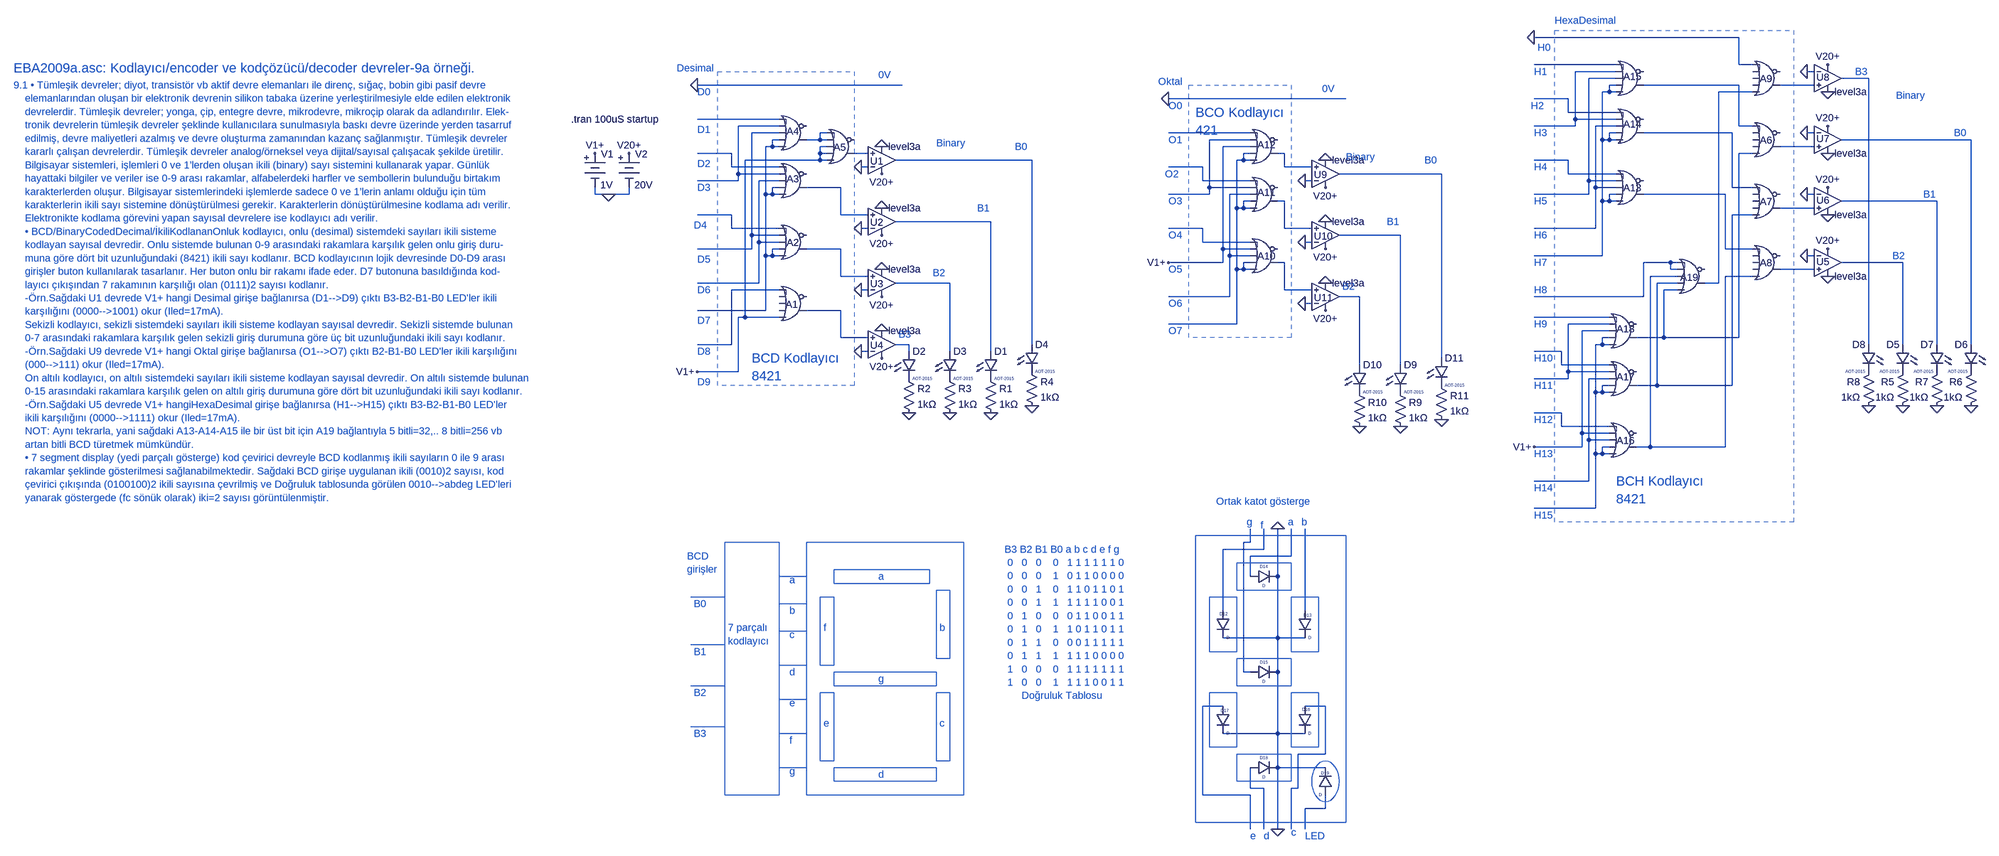
[diagram p0: schematic EBA2009a.asc]
EBA2009a.asc, the LTspice schematic file:
Version 4
SHEET 1 7064 4332
WIRE 4160 -16 3680 -16
WIRE 3872 48 3680 48
WIRE 4160 48 4160 -16
WIRE 4192 48 4160 48
WIRE 3872 64 3776 64
WIRE 4336 64 4320 64
WIRE 3872 80 3808 80
WIRE 4464 80 4400 80
WIRE 2032 96 1552 96
WIRE 3872 96 3856 96
WIRE 4160 96 3936 96
WIRE 4336 96 4256 96
WIRE 3856 112 3856 96
WIRE 3856 112 3840 112
WIRE 3872 112 3856 112
WIRE 4192 112 4112 112
WIRE 3072 128 2656 128
WIRE 3760 128 3680 128
WIRE 3760 160 3760 128
WIRE 3872 160 3760 160
WIRE 1744 176 1552 176
WIRE 3776 176 3776 64
WIRE 3872 176 3776 176
WIRE 1744 192 1648 192
WIRE 3776 192 3776 176
WIRE 3776 192 3680 192
WIRE 3872 192 3824 192
WIRE 4160 192 4160 96
WIRE 4192 192 4160 192
WIRE 1744 208 1680 208
WIRE 1856 208 1840 208
WIRE 2848 208 2656 208
WIRE 3872 208 3856 208
WIRE 4144 208 3936 208
WIRE 4336 208 4320 208
WIRE 1744 224 1728 224
WIRE 1840 224 1840 208
WIRE 1840 224 1808 224
WIRE 1856 224 1840 224
WIRE 2848 224 2752 224
WIRE 3840 224 3840 112
WIRE 3856 224 3856 208
WIRE 3856 224 3840 224
WIRE 3872 224 3856 224
WIRE 4704 224 4400 224
WIRE 1728 240 1728 224
WIRE 1728 240 1712 240
WIRE 1744 240 1728 240
WIRE 1856 240 1840 240
WIRE 2848 240 2784 240
WIRE 4336 240 4256 240
WIRE 1632 256 1552 256
WIRE 1840 256 1840 240
WIRE 1856 256 1840 256
WIRE 1952 256 1920 256
WIRE 2848 256 2832 256
WIRE 2928 256 2912 256
WIRE 4192 256 4160 256
WIRE 1840 272 1840 256
WIRE 1840 272 1664 272
WIRE 1856 272 1840 272
WIRE 2336 272 2016 272
WIRE 2832 272 2832 256
WIRE 2832 272 2816 272
WIRE 2848 272 2832 272
WIRE 3760 272 3680 272
WIRE 1632 288 1632 256
WIRE 1744 288 1632 288
WIRE 1952 288 1936 288
WIRE 2736 288 2656 288
WIRE 2928 288 2928 256
WIRE 2992 288 2928 288
WIRE 1648 304 1648 192
WIRE 1744 304 1648 304
WIRE 3296 304 3056 304
WIRE 3760 304 3760 272
WIRE 3872 304 3760 304
WIRE 1648 320 1648 304
WIRE 1648 320 1552 320
WIRE 1744 320 1696 320
WIRE 2736 320 2736 288
WIRE 2848 320 2736 320
WIRE 2992 320 2976 320
WIRE 3808 320 3808 80
WIRE 3872 320 3808 320
WIRE 1744 336 1728 336
WIRE 1888 336 1808 336
WIRE 2752 336 2752 224
WIRE 2848 336 2752 336
WIRE 3824 336 3824 192
WIRE 3872 336 3824 336
WIRE 4144 336 4144 208
WIRE 4192 336 4144 336
WIRE 1312 352 1312 336
WIRE 1344 352 1312 352
WIRE 1392 352 1392 336
WIRE 1392 352 1344 352
WIRE 1712 352 1712 240
WIRE 1728 352 1728 336
WIRE 1728 352 1712 352
WIRE 1744 352 1728 352
WIRE 2752 352 2752 336
WIRE 2752 352 2656 352
WIRE 2848 352 2800 352
WIRE 3808 352 3808 320
WIRE 3808 352 3680 352
WIRE 3872 352 3856 352
WIRE 4128 352 3936 352
WIRE 4336 352 4320 352
WIRE 2848 368 2832 368
WIRE 2928 368 2912 368
WIRE 3840 368 3840 224
WIRE 3856 368 3856 352
WIRE 3856 368 3840 368
WIRE 3872 368 3856 368
WIRE 4624 368 4400 368
WIRE 2816 384 2816 272
WIRE 2832 384 2832 368
WIRE 2832 384 2816 384
WIRE 2848 384 2832 384
WIRE 4336 384 4256 384
WIRE 1632 400 1552 400
WIRE 1888 400 1888 336
WIRE 1952 400 1888 400
WIRE 4192 400 4144 400
WIRE 2240 416 2016 416
WIRE 1632 432 1632 400
WIRE 1744 432 1632 432
WIRE 1952 432 1936 432
WIRE 2736 432 2656 432
WIRE 2928 432 2928 368
WIRE 2992 432 2928 432
WIRE 3824 432 3824 336
WIRE 3824 432 3680 432
WIRE 1680 448 1680 208
WIRE 1744 448 1680 448
WIRE 3200 448 3056 448
WIRE 1696 464 1696 320
WIRE 1744 464 1696 464
WIRE 2736 464 2736 432
WIRE 2848 464 2736 464
WIRE 2992 464 2976 464
WIRE 1680 480 1680 448
WIRE 1680 480 1552 480
WIRE 1744 480 1728 480
WIRE 1888 480 1808 480
WIRE 2784 480 2784 240
WIRE 2848 480 2784 480
WIRE 4128 480 4128 352
WIRE 4192 480 4128 480
WIRE 1712 496 1712 352
WIRE 1728 496 1728 480
WIRE 1728 496 1712 496
WIRE 1744 496 1728 496
WIRE 2800 496 2800 352
WIRE 2848 496 2800 496
WIRE 3840 496 3840 368
WIRE 3840 496 3680 496
WIRE 4336 496 4320 496
WIRE 2784 512 2784 480
WIRE 2784 512 2656 512
WIRE 2848 512 2832 512
WIRE 2928 512 2912 512
WIRE 4000 512 3936 512
WIRE 4016 512 4000 512
WIRE 4544 512 4400 512
WIRE 2816 528 2816 384
WIRE 2832 528 2832 512
WIRE 2832 528 2816 528
WIRE 2848 528 2832 528
WIRE 4000 528 4000 512
WIRE 4016 528 4000 528
WIRE 4336 528 4256 528
WIRE 1888 544 1888 480
WIRE 1952 544 1888 544
WIRE 4016 544 3952 544
WIRE 4192 544 4128 544
WIRE 1696 560 1696 464
WIRE 1696 560 1552 560
WIRE 2144 560 2016 560
WIRE 4016 560 3968 560
WIRE 4112 560 4112 112
WIRE 4112 560 4080 560
WIRE 1744 576 1632 576
WIRE 1952 576 1936 576
WIRE 2928 576 2928 512
WIRE 2992 576 2928 576
WIRE 4016 576 3984 576
WIRE 2800 592 2800 496
WIRE 2800 592 2656 592
WIRE 3104 592 3056 592
WIRE 3936 592 3936 512
WIRE 3936 592 3680 592
WIRE 2992 608 2976 608
WIRE 1712 624 1712 496
WIRE 1712 624 1552 624
WIRE 1888 624 1808 624
WIRE 1664 640 1664 272
WIRE 1664 640 1648 640
WIRE 1744 640 1664 640
WIRE 3856 640 3680 640
WIRE 2816 656 2816 528
WIRE 2816 656 2656 656
WIRE 3856 656 3760 656
WIRE 3856 672 3792 672
WIRE 1888 688 1888 624
WIRE 1952 688 1888 688
WIRE 3856 688 3840 688
WIRE 3984 688 3984 576
WIRE 3984 688 3920 688
WIRE 4160 688 4160 256
WIRE 4160 688 3984 688
WIRE 1632 704 1632 576
WIRE 1632 704 1552 704
WIRE 2048 704 2016 704
WIRE 2336 704 2336 272
WIRE 3840 704 3840 688
WIRE 3840 704 3824 704
WIRE 3856 704 3840 704
WIRE 4464 704 4464 80
WIRE 4544 704 4544 512
WIRE 4624 704 4624 368
WIRE 4704 704 4704 224
WIRE 1952 720 1936 720
WIRE 2048 720 2048 704
WIRE 2144 720 2144 560
WIRE 2240 720 2240 416
WIRE 3744 720 3680 720
WIRE 3296 736 3296 304
WIRE 3104 752 3104 592
WIRE 3200 752 3200 448
WIRE 3744 752 3744 720
WIRE 3856 752 3744 752
WIRE 1648 768 1648 640
WIRE 1648 768 1552 768
WIRE 3760 768 3760 656
WIRE 3856 768 3760 768
WIRE 3760 784 3760 768
WIRE 3760 784 3680 784
WIRE 3856 784 3808 784
WIRE 3856 800 3840 800
WIRE 3968 800 3968 560
WIRE 3968 800 3920 800
WIRE 4144 800 4144 400
WIRE 4144 800 3968 800
WIRE 3824 816 3824 704
WIRE 3840 816 3840 800
WIRE 3840 816 3824 816
WIRE 3856 816 3840 816
WIRE 3744 864 3680 864
WIRE 3744 896 3744 864
WIRE 3856 896 3744 896
WIRE 3792 912 3792 672
WIRE 3856 912 3792 912
WIRE 3808 928 3808 784
WIRE 3856 928 3808 928
WIRE 3792 944 3792 912
WIRE 3792 944 3680 944
WIRE 3856 944 3840 944
WIRE 3952 944 3952 544
WIRE 3952 944 3920 944
WIRE 4128 944 4128 544
WIRE 4128 944 3952 944
WIRE 3824 960 3824 816
WIRE 3840 960 3840 944
WIRE 3840 960 3824 960
WIRE 3856 960 3840 960
WIRE 3808 1024 3808 928
WIRE 3808 1024 3680 1024
WIRE 3824 1088 3824 960
WIRE 3824 1088 3680 1088
WIRE 2848 1168 2848 1136
WIRE 2848 1168 2832 1168
WIRE 2880 1184 2880 1136
WIRE 2880 1184 2784 1184
WIRE 2944 1200 2944 1136
WIRE 2944 1200 2848 1200
WIRE 2848 1248 2848 1200
WIRE 2912 1248 2912 1136
WIRE 2784 1328 2784 1184
WIRE 2976 1328 2976 1136
WIRE 2912 1392 2912 1248
WIRE 2912 1392 2784 1392
WIRE 2976 1392 2912 1392
WIRE 2832 1472 2832 1168
WIRE 2848 1472 2832 1472
WIRE 2912 1472 2912 1392
WIRE 2784 1552 2736 1552
WIRE 3024 1552 2976 1552
WIRE 2912 1616 2912 1472
WIRE 2912 1616 2784 1616
WIRE 2976 1616 2912 1616
WIRE 3024 1664 3024 1552
WIRE 3024 1664 2960 1664
WIRE 2912 1696 2912 1616
WIRE 3024 1696 2912 1696
WIRE 2848 1744 2848 1696
WIRE 2880 1744 2848 1744
WIRE 2960 1744 2960 1664
WIRE 2960 1744 2944 1744
WIRE 2736 1760 2736 1552
WIRE 2848 1760 2736 1760
WIRE 3024 1792 3024 1760
WIRE 3024 1792 2976 1792
WIRE 2848 1840 2848 1760
WIRE 2880 1840 2880 1744
WIRE 2912 1840 2912 1696
WIRE 2944 1840 2944 1744
WIRE 2976 1840 2976 1792
FLAG 1984 240 0
FLAG 1984 304 V20+
FLAG 1936 288 0
FLAG 2240 864 0
FLAG 2048 864 0
FLAG 2144 864 0
FLAG 1552 768 V1+
FLAG 1312 256 V1+
FLAG 1392 256 V20+
FLAG 1344 352 0
FLAG 2336 848 0
FLAG 1984 384 0
FLAG 1984 448 V20+
FLAG 1936 432 0
FLAG 1984 528 0
FLAG 1984 592 V20+
FLAG 1936 576 0
FLAG 1984 672 0
FLAG 1984 736 V20+
FLAG 1936 720 0
FLAG 1552 96 0
FLAG 4368 544 0
FLAG 4368 480 V20+
FLAG 4320 496 0
FLAG 4544 848 0
FLAG 4368 400 0
FLAG 4368 336 V20+
FLAG 4320 352 0
FLAG 4368 256 0
FLAG 4368 192 V20+
FLAG 4320 208 0
FLAG 4704 848 0
FLAG 4624 848 0
FLAG 4368 112 0
FLAG 4368 48 V20+
FLAG 4320 64 0
FLAG 4464 848 0
FLAG 3024 272 0
FLAG 3024 336 V20+
FLAG 2976 320 0
FLAG 3200 896 0
FLAG 3104 896 0
FLAG 2656 512 V1+
FLAG 3296 880 0
FLAG 3024 416 0
FLAG 3024 480 V20+
FLAG 2976 464 0
FLAG 3024 560 0
FLAG 3024 624 V20+
FLAG 2976 608 0
FLAG 2656 128 0
FLAG 3680 944 V1+
FLAG 3680 -16 0
FLAG 2912 1136 0
FLAG 2912 1840 0
SYMBOL Digital\\or 1776 672 M180
WINDOW 0 -17 62 Left 2
SYMATTR InstName A1
SYMBOL Digital\\or 1776 528 M180
WINDOW 0 -15 63 Left 2
SYMATTR InstName A2
SYMBOL Digital\\or 1776 384 M180
WINDOW 0 -15 68 Left 2
SYMATTR InstName A3
SYMBOL OpAmps\\UniversalOpAmp3 1984 272 M180
WINDOW 0 -27 -2 Left 2
SYMATTR InstName U1
SYMBOL res 2224 768 R0
SYMATTR InstName R1
SYMATTR Value 1kΩ
SYMBOL LED 2224 720 R0
WINDOW 3 24 64 Left 0
SYMATTR Value AOT-2015
SYMATTR InstName D1
SYMATTR Description Diode
SYMATTR Type diode
SYMBOL res 2032 768 R0
SYMATTR InstName R2
SYMATTR Value 1kΩ
SYMBOL LED 2032 720 R0
WINDOW 3 24 64 Left 0
SYMATTR Value AOT-2015
SYMATTR InstName D2
SYMATTR Description Diode
SYMATTR Type diode
SYMBOL res 2128 768 R0
SYMATTR InstName R3
SYMATTR Value 1kΩ
SYMBOL LED 2128 720 R0
WINDOW 3 24 64 Left 0
SYMATTR Value AOT-2015
SYMATTR InstName D3
SYMATTR Description Diode
SYMATTR Type diode
SYMBOL Misc\\battery 1312 240 R0
WINDOW 0 14 18 Left 2
WINDOW 3 13 90 Left 2
SYMATTR InstName V1
SYMATTR Value 1V
SYMBOL Misc\\battery 1392 240 R0
WINDOW 0 14 18 Left 2
WINDOW 3 13 90 Left 2
SYMATTR InstName V2
SYMATTR Value 20V
SYMBOL Digital\\or 1776 272 M180
WINDOW 0 -15 68 Left 2
SYMATTR InstName A4
SYMBOL Digital\\or 1888 304 M180
WINDOW 0 -17 62 Left 2
SYMATTR InstName A5
SYMBOL res 2320 752 R0
SYMATTR InstName R4
SYMATTR Value 1kΩ
SYMBOL LED 2320 704 R0
WINDOW 3 24 64 Left 0
SYMATTR Value AOT-2015
SYMATTR InstName D4
SYMATTR Description Diode
SYMATTR Type diode
SYMBOL OpAmps\\UniversalOpAmp3 1984 416 M180
WINDOW 0 -27 -2 Left 2
SYMATTR InstName U2
SYMBOL OpAmps\\UniversalOpAmp3 1984 560 M180
WINDOW 0 -27 -2 Left 2
SYMATTR InstName U3
SYMBOL OpAmps\\UniversalOpAmp3 1984 704 M180
WINDOW 0 -27 -2 Left 2
SYMATTR InstName U4
SYMBOL OpAmps\\UniversalOpAmp3 4368 512 R0
WINDOW 0 -27 -2 Left 2
SYMATTR InstName U5
SYMBOL res 4560 752 M0
SYMATTR InstName R5
SYMATTR Value 1kΩ
SYMBOL LED 4560 704 M0
WINDOW 3 24 64 Left 0
SYMATTR Value AOT-2015
SYMATTR InstName D5
SYMATTR Description Diode
SYMATTR Type diode
SYMBOL OpAmps\\UniversalOpAmp3 4368 368 R0
WINDOW 0 -27 -2 Left 2
SYMATTR InstName U6
SYMBOL OpAmps\\UniversalOpAmp3 4368 224 R0
WINDOW 0 -27 -2 Left 2
SYMATTR InstName U7
SYMBOL res 4720 752 M0
SYMATTR InstName R6
SYMATTR Value 1kΩ
SYMBOL LED 4720 704 M0
WINDOW 3 24 64 Left 0
SYMATTR Value AOT-2015
SYMATTR InstName D6
SYMATTR Description Diode
SYMATTR Type diode
SYMBOL res 4640 752 M0
SYMATTR InstName R7
SYMATTR Value 1kΩ
SYMBOL LED 4640 704 M0
WINDOW 3 24 64 Left 0
SYMATTR Value AOT-2015
SYMATTR InstName D7
SYMATTR Description Diode
SYMATTR Type diode
SYMBOL Digital\\or 4224 288 M180
WINDOW 0 -15 63 Left 2
SYMATTR InstName A6
SYMBOL Digital\\or 4224 432 M180
WINDOW 0 -15 63 Left 2
SYMATTR InstName A7
SYMBOL Digital\\or 4224 576 M180
WINDOW 0 -15 63 Left 2
SYMATTR InstName A8
SYMBOL Digital\\or 4224 144 M180
WINDOW 0 -15 63 Left 2
SYMATTR InstName A9
SYMBOL OpAmps\\UniversalOpAmp3 4368 80 R0
WINDOW 0 -27 -2 Left 2
SYMATTR InstName U8
SYMBOL res 4480 752 M0
SYMATTR InstName R8
SYMATTR Value 1kΩ
SYMBOL LED 4480 704 M0
WINDOW 3 24 64 Left 0
SYMATTR Value AOT-2015
SYMATTR InstName D8
SYMATTR Description Diode
SYMATTR Type diode
SYMBOL Digital\\or 2880 560 M180
WINDOW 0 -15 63 Left 2
SYMATTR InstName A10
SYMBOL Digital\\or 2880 416 M180
WINDOW 0 -15 68 Left 2
SYMATTR InstName A11
SYMBOL OpAmps\\UniversalOpAmp3 3024 304 M180
WINDOW 0 -27 -2 Left 2
SYMATTR InstName U9
SYMBOL res 3184 800 R0
SYMATTR InstName R9
SYMATTR Value 1kΩ
SYMBOL LED 3184 752 R0
WINDOW 3 24 64 Left 0
SYMATTR Value AOT-2015
SYMATTR InstName D9
SYMATTR Description Diode
SYMATTR Type diode
SYMBOL res 3088 800 R0
SYMATTR InstName R10
SYMATTR Value 1kΩ
SYMBOL LED 3088 752 R0
WINDOW 3 24 64 Left 0
SYMATTR Value AOT-2015
SYMATTR InstName D10
SYMATTR Description Diode
SYMATTR Type diode
SYMBOL Digital\\or 2880 304 M180
WINDOW 0 -15 68 Left 2
SYMATTR InstName A12
SYMBOL res 3280 784 R0
SYMATTR InstName R11
SYMATTR Value 1kΩ
SYMBOL LED 3280 736 R0
WINDOW 3 24 64 Left 0
SYMATTR Value AOT-2015
SYMATTR InstName D11
SYMATTR Description Diode
SYMATTR Type diode
SYMBOL OpAmps\\UniversalOpAmp3 3024 448 M180
WINDOW 0 -27 -2 Left 2
SYMATTR InstName U10
SYMBOL OpAmps\\UniversalOpAmp3 3024 592 M180
WINDOW 0 -27 -2 Left 2
SYMATTR InstName U11
SYMBOL Digital\\or 3904 400 M180
WINDOW 0 -15 63 Left 2
SYMATTR InstName A13
SYMBOL Digital\\or 3904 256 M180
WINDOW 0 -15 68 Left 2
SYMATTR InstName A14
SYMBOL Digital\\or 3904 144 M180
WINDOW 0 -15 68 Left 2
SYMATTR InstName A15
SYMBOL Digital\\or 3888 992 M180
WINDOW 0 -15 63 Left 2
SYMATTR InstName A16
SYMBOL Digital\\or 3888 848 M180
WINDOW 0 -15 68 Left 2
SYMATTR InstName A17
SYMBOL Digital\\or 3888 736 M180
WINDOW 0 -15 68 Left 2
SYMATTR InstName A18
SYMBOL Digital\\or 4048 608 M180
WINDOW 0 -26 61 Left 2
SYMATTR InstName A19
SYMBOL diode 2768 1328 R0
WINDOW 0 8 8 Left 0
WINDOW 3 24 64 Left 0
SYMATTR InstName D12
SYMBOL diode 2960 1328 R0
WINDOW 0 13 11 Left 0
WINDOW 3 24 64 Left 0
SYMATTR InstName D13
SYMBOL diode 2848 1264 R270
WINDOW 0 32 32 VTop 0
WINDOW 3 0 32 VBottom 0
SYMATTR InstName D14
SYMBOL diode 2848 1488 R270
WINDOW 0 32 32 VTop 0
WINDOW 3 0 32 VBottom 0
SYMATTR InstName D15
SYMBOL diode 2960 1552 R0
WINDOW 0 10 8 Left 0
WINDOW 3 24 64 Left 0
SYMATTR InstName D16
SYMBOL diode 2768 1552 R0
WINDOW 0 11 11 Left 0
WINDOW 3 24 64 Left 0
SYMATTR InstName D17
SYMBOL diode 2848 1712 R270
WINDOW 0 32 32 VTop 0
WINDOW 3 0 32 VBottom 0
SYMATTR InstName D18
SYMBOL diode 3040 1760 R180
WINDOW 0 8 51 Left 0
WINDOW 3 24 0 Left 0
SYMATTR InstName D19
TEXT -232 56 Left 3 ;EBA2009a.asc: Kodlayıcı/encoder ve kodçözücü/decoder devreler-9a örneği.
TEXT -232 96 Left 2 ;9.1 • Tümleşik devreler; diyot, transistör vb aktif devre elemanları ile direnç, sığaç, bobin gibi pasif devre \n    elemanlarından oluşan bir elektronik devrenin silikon tabaka üzerine yerleştirilmesiyle elde edilen elektronik \n    devrelerdir. Tümleşik devreler; yonga, çip, entegre devre, mikrodevre, mikroçip olarak da adlandırılır. Elek-\n    tronik devrelerin tümleşik devreler şeklinde kullanıcılara sunulmasıyla baskı devre üzerinde yerden tasarruf \n    edilmiş, devre maliyetleri azalmış ve devre oluşturma zamanından kazanç sağlanmıştır. Tümleşik devreler \n    kararlı çalışan devrelerdir. Tümleşik devreler analog/örneksel veya dijital/sayısal çalışacak şekilde üretilir.\n    Bilgisayar sistemleri, işlemleri 0 ve 1’lerden oluşan ikili (binary) sayı sistemini kullanarak yapar. Günlük\n    hayattaki bilgiler ve veriler ise 0-9 arası rakamlar, alfabelerdeki harfler ve sembollerin bulunduğu birtakım \n    karakterlerden oluşur. Bilgisayar sistemlerindeki işlemlerde sadece 0 ve 1’lerin anlamı olduğu için tüm \n    karakterlerin ikili sayı sistemine dönüştürülmesi gerekir. Karakterlerin dönüştürülmesine kodlama adı verilir. \n    Elektronikte kodlama görevini yapan sayısal devrelere ise kodlayıcı adı verilir.\n    • BCD/BinaryCodedDecimal/İkiliKodlananOnluk kodlayıcı, onlu (desimal) sistemdeki sayıları ikili sisteme \n    kodlayan sayısal devredir. Onlu sistemde bulunan 0-9 arasındaki rakamlara karşılık gelen onlu giriş duru-\n    muna göre dört bit uzunluğundaki (8421) ikili sayı kodlanır. BCD kodlayıcının lojik devresinde D0-D9 arası \n    girişler buton kullanılarak tasarlanır. Her buton onlu bir rakamı ifade eder. D7 butonuna basıldığında kod-\n    layıcı çıkışından 7 rakamının karşılığı olan (0111)2 sayısı kodlanır.\n    -Örn.Sağdaki U1 devrede V1+ hangi Desimal girişe bağlanırsa (D1-->D9) çıktı B3-B2-B1-B0 LED'ler ikili\n    karşılığını (0000-->1001) okur (Iled=17mA).\n    Sekizli kodlayıcı, sekizli sistemdeki sayıları ikili sisteme kodlayan sayısal devredir. Sekizli sistemde bulunan\n    0-7 arasındaki rakamlara karşılık gelen sekizli giriş durumuna göre üç bit uzunluğundaki ikili sayı kodlanır.\n    -Örn.Sağdaki U9 devrede V1+ hangi Oktal girişe bağlanırsa (O1-->O7) çıktı B2-B1-B0 LED'ler ikili karşılığını \n    (000-->111) okur (Iled=17mA).\n    On altılı kodlayıcı, on altılı sistemdeki sayıları ikili sisteme kodlayan sayısal devredir. On altılı sistemde bulunan \n    0-15 arasındaki rakamlara karşılık gelen on altılı giriş durumuna göre dört bit uzunluğundaki ikili sayı kodlanır.\n    -Örn.Sağdaki U5 devrede V1+ hangiHexaDesimal girişe bağlanırsa (H1-->H15) çıktı B3-B2-B1-B0 LED'ler \n    ikili karşılığını (0000-->1111) okur (Iled=17mA).\n    NOT: Aynı tekrarla, yani sağdaki A13-A14-A15 ile bir üst bit için A19 bağlantıyla 5 bitli=32,.. 8 bitli=256 vb\n    artan bitli BCD türetmek mümkündür.\n    • 7 segment display (yedi parçalı gösterge) kod çevirici devreyle BCD kodlanmış ikili sayıların 0 ile 9 arası \n    rakamlar şeklinde gösterilmesi sağlanabilmektedir. Sağdaki BCD girişe uygulanan ikili (0010)2 sayısı, kod \n    çevirici çıkışında (0100100)2 ikili sayısına çevrilmiş ve Doğruluk tablosunda görülen 0010-->abdeg LED'leri\n    yanarak göstergede (fc sönük olarak) iki=2 sayısı görüntülenmiştir.
TEXT 1552 648 Left 2 ;D7
TEXT 1552 576 Left 2 ;D6
TEXT 1552 504 Left 2 ;D5
TEXT 1544 424 Left 2 ;D4
TEXT 1552 336 Left 2 ;D3
TEXT 1552 280 Left 2 ;D2
TEXT 1552 200 Left 2 ;D1
TEXT 1552 112 Left 2 ;D0
TEXT 1256 176 Left 2 !.tran 100uS startup
TEXT 1552 792 Left 2 ;D9
TEXT 1552 720 Left 2 ;D8
TEXT 2296 240 Left 2 ;B0
TEXT 2208 384 Left 2 ;B1
TEXT 2104 536 Left 2 ;B2
TEXT 2024 680 Left 2 ;B3
TEXT 1976 72 Left 2 ;0V
TEXT 1680 736 Left 3 ;BCD Kodlayıcı\n8421
TEXT 2112 232 Left 2 ;Binary
TEXT 1504 56 Left 2 ;Desimal
TEXT 4664 208 Left 2 ;B0
TEXT 4592 352 Left 2 ;B1
TEXT 4520 496 Left 2 ;B2
TEXT 4432 64 Left 2 ;B3
TEXT 4528 120 Left 2 ;Binary
TEXT 2656 672 Left 2 ;O7
TEXT 2656 608 Left 2 ;O6
TEXT 2656 528 Left 2 ;O5
TEXT 2656 448 Left 2 ;O4
TEXT 2656 368 Left 2 ;O3
TEXT 2648 304 Left 2 ;O2
TEXT 2656 224 Left 2 ;O1
TEXT 2656 144 Left 2 ;O0
TEXT 3256 272 Left 2 ;B0
TEXT 3168 416 Left 2 ;B1
TEXT 3064 568 Left 2 ;B2
TEXT 3016 104 Left 2 ;0V
TEXT 2720 160 Left 3 ;BCO Kodlayıcı\n421
TEXT 3072 264 Left 2 ;Binary
TEXT 2632 88 Left 2 ;Oktal
TEXT 3680 512 Left 2 ;H7
TEXT 3680 448 Left 2 ;H6
TEXT 3680 368 Left 2 ;H5
TEXT 3680 288 Left 2 ;H4
TEXT 3680 208 Left 2 ;H3
TEXT 3672 144 Left 2 ;H2
TEXT 3680 64 Left 2 ;H1
TEXT 3688 8 Left 2 ;H0
TEXT 3680 1104 Left 2 ;H15
TEXT 3680 1040 Left 2 ;H14
TEXT 3680 960 Left 2 ;H13
TEXT 3680 880 Left 2 ;H12
TEXT 3680 800 Left 2 ;H11
TEXT 3680 736 Left 2 ;H10
TEXT 3680 656 Left 2 ;H9
TEXT 3680 576 Left 2 ;H8
TEXT 3728 -56 Left 2 ;HexaDesimal
TEXT 3872 1024 Left 3 ;BCH Kodlayıcı\n8421
TEXT 1544 1312 Left 2 ;B0
TEXT 1544 1424 Left 2 ;B1
TEXT 1544 1520 Left 2 ;B2
TEXT 1544 1616 Left 2 ;B3
TEXT 1768 1256 Left 2 ;a
TEXT 1768 1328 Left 2 ;b
TEXT 1768 1384 Left 2 ;c
TEXT 1768 1472 Left 2 ;d
TEXT 1768 1544 Left 2 ;e
TEXT 1768 1632 Left 2 ;f
TEXT 1768 1704 Left 2 ;g
TEXT 1976 1248 Left 2 ;a
TEXT 2120 1368 Left 2 ;b
TEXT 2120 1592 Left 2 ;c
TEXT 1976 1712 Left 2 ;d
TEXT 1848 1592 Left 2 ;e
TEXT 1848 1368 Left 2 ;f
TEXT 1976 1488 Left 2 ;g
TEXT 1528 1200 Left 2 ;BCD \ngirişler
TEXT 1624 1368 Left 2 ;7 parçalı\nkodlayıcı
TEXT 2272 1184 Left 2 ;B3 B2 B1 B0 a b c d e f g\n 0   0   0    0   1 1 1 1 1 1 0\n 0   0   0    1   0 1 1 0 0 0 0\n 0   0   1    0   1 1 0 1 1 0 1\n 0   0   1    1   1 1 1 1 0 0 1\n 0   1   0    0   0 1 1 0 0 1 1\n 0   1   0    1   1 0 1 1 0 1 1\n 0   1   1    0   0 0 1 1 1 1 1\n 0   1   1    1   1 1 1 0 0 0 0\n 1   0   0    0   1 1 1 1 1 1 1\n 1   0   0    1   1 1 1 0 0 1 1\n      Doğruluk Tablosu
TEXT 2936 1120 Left 2 ;a
TEXT 2968 1120 Left 2 ;b
TEXT 2840 1120 Left 2 ;g
TEXT 2872 1128 Left 2 ;f
TEXT 2848 1856 Left 2 ;e
TEXT 2880 1856 Left 2 ;d
TEXT 2944 1848 Left 2 ;c
TEXT 2976 1856 Left 2 ;LED
TEXT 2768 1072 Left 2 ;Ortak katot gösterge
LINE Normal 1536 1296 1616 1296
LINE Normal 1536 1408 1616 1408
LINE Normal 1536 1504 1616 1504
LINE Normal 1536 1600 1616 1600
LINE Normal 1808 1248 1744 1248
LINE Normal 1808 1312 1744 1312
LINE Normal 1744 1376 1808 1376
LINE Normal 1744 1456 1808 1456
LINE Normal 1744 1536 1808 1536
LINE Normal 1744 1616 1808 1616
LINE Normal 1744 1696 1808 1696
RECTANGLE Normal 1920 800 1600 64 2
RECTANGLE Normal 2944 688 2704 96 2
RECTANGLE Normal 4288 1120 3728 -32 2
RECTANGLE Normal 1744 1760 1616 1168
RECTANGLE Normal 2176 1760 1808 1168
RECTANGLE Normal 2096 1264 1872 1232
RECTANGLE Normal 2112 1504 1872 1472
RECTANGLE Normal 2112 1728 1872 1696
RECTANGLE Normal 1872 1456 1840 1296
RECTANGLE Normal 2144 1440 2112 1280
RECTANGLE Normal 2144 1680 2112 1520
RECTANGLE Normal 1872 1680 1840 1520
RECTANGLE Normal 2816 1424 2752 1296
RECTANGLE Normal 3008 1424 2944 1296
RECTANGLE Normal 2944 1216 2816 1280
RECTANGLE Normal 2944 1440 2816 1504
RECTANGLE Normal 3008 1648 2944 1520
RECTANGLE Normal 2816 1648 2752 1520
RECTANGLE Normal 2944 1664 2816 1728
RECTANGLE Normal 3072 1824 2720 1152
CIRCLE Normal 3056 1776 2992 1680

The netlist it stands for:
* EBA2009a.asc
A1 V1+ 0 0 0 N049 0 N051 0 OR
A2 N017 N017 N030 N013 N037 0 N042 0 OR
A3 N017 N017 N030 N011 N021 0 N031 0 OR
XU1 N022 0 V20+ 0 N026 level3a  ; pins In+ In- V+ V- OUT
R1 P001 0 1kΩ
D1 N039 P001 AOT-2015
R2 P002 0 1kΩ
D2 N055 P002 AOT-2015
R3 P003 0 1kΩ
D3 N048 P003 AOT-2015
V1 V1+ 0 1V
V2 V20+ 0 20V
A4 N017 N017 N013 N011 N010 0 N014 0 OR
A5 V1+ V1+ V1+ N014 N014 0 N022 0 OR
R4 P004 0 1kΩ
D4 N026 P004 AOT-2015
XU2 N031 0 V20+ 0 N039 level3a  ; pins In+ In- V+ V- OUT
XU3 N042 0 V20+ 0 N048 level3a  ; pins In+ In- V+ V- OUT
XU4 N051 0 V20+ 0 N055 level3a  ; pins In+ In- V+ V- OUT
XU5 N046 0 V20+ 0 N045 level3a  ; pins In+ In- V+ V- OUT
R5 P005 0 1kΩ
D5 N045 P005 AOT-2015
XU6 N036 0 V20+ 0 N035 level3a  ; pins In+ In- V+ V- OUT
XU7 N020 0 V20+ 0 N019 level3a  ; pins In+ In- V+ V- OUT
R6 P006 0 1kΩ
D6 N019 P006 AOT-2015
R7 P007 0 1kΩ
D7 N035 P007 AOT-2015
A6 N025 0 0 0 N006 0 N020 0 OR
A7 N038 0 0 0 N016 0 N036 0 OR
A8 N047 0 0 0 N033 0 N046 0 OR
A9 N008 0 0 0 0 0 N007 0 OR
XU8 N007 0 V20+ 0 N004 level3a  ; pins In+ In- V+ V- OUT
R8 P008 0 1kΩ
D8 N004 P008 AOT-2015
A10 N023 N023 N032 V1+ N040 0 N043 0 OR
A11 N023 N023 N032 N018 N028 0 N034 0 OR
XU9 N024 0 V20+ 0 N029 level3a  ; pins In+ In- V+ V- OUT
R9 P009 0 1kΩ
D9 N041 P009 AOT-2015
R10 P010 0 1kΩ
D10 N050 P010 AOT-2015
A12 N023 N023 V1+ N018 N015 0 N024 0 OR
R11 P011 0 1kΩ
D11 N029 P011 AOT-2015
XU10 N034 0 V20+ 0 N041 level3a  ; pins In+ In- V+ V- OUT
XU11 N043 0 V20+ 0 N050 level3a  ; pins In+ In- V+ V- OUT
A13 N005 N005 N012 N003 N027 0 N033 0 OR
A14 N005 N005 N012 N002 N009 0 N016 0 OR
A15 N005 N005 N003 N002 N001 0 N006 0 OR
A16 N054 N054 N057 V1+ N058 0 N047 0 OR
A17 N054 N054 N057 N053 N056 0 N038 0 OR
A18 N054 N054 V1+ N053 N052 0 N025 0 OR
A19 N025 N038 N047 N044 N044 0 N008 0 OR
D12 N060 0 D
D13 N062 0 D
D14 N061 0 D
D15 N059 0 D
D16 N064 0 D
D17 N063 0 D
D18 N065 0 D
D19 N066 0 D
.model D D
.lib standard.dio
* EBA2009a.asc: Kodlayıcı/encoder ve kodçözücü/decoder devreler-9a örneği.
* 9.1 • Tümleşik devreler; diyot, transistör vb aktif devre elemanları ile direnç, sığaç, bobin gibi pasif devre
*     elemanlarından oluşan bir elektronik devrenin silikon tabaka üzerine yerleştirilmesiyle elde edilen elektronik
*     devrelerdir. Tümleşik devreler; yonga, çip, entegre devre, mikrodevre, mikroçip olarak da adlandırılır. Elek-
*     tronik devrelerin tümleşik devreler şeklinde kullanıcılara sunulmasıyla baskı devre üzerinde yerden tasarruf
*     edilmiş, devre maliyetleri azalmış ve devre oluşturma zamanından kazanç sağlanmıştır. Tümleşik devreler
*     kararlı çalışan devrelerdir. Tümleşik devreler analog/örneksel veya dijital/sayısal çalışacak şekilde üretilir.
*     Bilgisayar sistemleri, işlemleri 0 ve 1’lerden oluşan ikili (binary) sayı sistemini kullanarak yapar. Günlük
*     hayattaki bilgiler ve veriler ise 0-9 arası rakamlar, alfabelerdeki harfler ve sembollerin bulunduğu birtakım
*     karakterlerden oluşur. Bilgisayar sistemlerindeki işlemlerde sadece 0 ve 1’lerin anlamı olduğu için tüm
*     karakterlerin ikili sayı sistemine dönüştürülmesi gerekir. Karakterlerin dönüştürülmesine kodlama adı verilir.
*     Elektronikte kodlama görevini yapan sayısal devrelere ise kodlayıcı adı verilir.
*     • BCD/BinaryCodedDecimal/İkiliKodlananOnluk kodlayıcı, onlu (desimal) sistemdeki sayıları ikili sisteme
*     kodlayan sayısal devredir. Onlu sistemde bulunan 0-9 arasındaki rakamlara karşılık gelen onlu giriş duru-
*     muna göre dört bit uzunluğundaki (8421) ikili sayı kodlanır. BCD kodlayıcının lojik devresinde D0-D9 arası
*     girişler buton kullanılarak tasarlanır. Her buton onlu bir rakamı ifade eder. D7 butonuna basıldığında kod-
*     layıcı çıkışından 7 rakamının karşılığı olan (0111)2 sayısı kodlanır.
*     -Örn.Sağdaki U1 devrede V1+ hangi Desimal girişe bağlanırsa (D1-->D9) çıktı B3-B2-B1-B0 LED'ler ikili
*     karşılığını (0000-->1001) okur (Iled=17mA).
*     Sekizli kodlayıcı, sekizli sistemdeki sayıları ikili sisteme kodlayan sayısal devredir. Sekizli sistemde bulunan
*     0-7 arasındaki rakamlara karşılık gelen sekizli giriş durumuna göre üç bit uzunluğundaki ikili sayı kodlanır.
*     -Örn.Sağdaki U9 devrede V1+ hangi Oktal girişe bağlanırsa (O1-->O7) çıktı B2-B1-B0 LED'ler ikili karşılığını
*     (000-->111) okur (Iled=17mA).
*     On altılı kodlayıcı, on altılı sistemdeki sayıları ikili sisteme kodlayan sayısal devredir. On altılı sistemde bulunan
*     0-15 arasındaki rakamlara karşılık gelen on altılı giriş durumuna göre dört bit uzunluğundaki ikili sayı kodlanır.
*     -Örn.Sağdaki U5 devrede V1+ hangiHexaDesimal girişe bağlanırsa (H1-->H15) çıktı B3-B2-B1-B0 LED'ler
*     ikili karşılığını (0000-->1111) okur (Iled=17mA).
*     NOT: Aynı tekrarla, yani sağdaki A13-A14-A15 ile bir üst bit için A19 bağlantıyla 5 bitli=32,.. 8 bitli=256 vb
*     artan bitli BCD türetmek mümkündür.
*     • 7 segment display (yedi parçalı gösterge) kod çevirici devreyle BCD kodlanmış ikili sayıların 0 ile 9 arası
*     rakamlar şeklinde gösterilmesi sağlanabilmektedir. Sağdaki BCD girişe uygulanan ikili (0010)2 sayısı, kod
*     çevirici çıkışında (0100100)2 ikili sayısına çevrilmiş ve Doğruluk tablosunda görülen 0010-->abdeg LED'leri
*     yanarak göstergede (fc sönük olarak) iki=2 sayısı görüntülenmiştir.
* D7
* D6
* D5
* D4
* D3
* D2
* D1
* D0
.tran 100uS startup
* D9
* D8
* B0
* B1
* B2
* B3
* 0V
* BCD Kodlayıcı
* 8421
* Binary
* Desimal
* B0
* B1
* B2
* B3
* Binary
* O7
* O6
* O5
* O4
* O3
* O2
* O1
* O0
* B0
* B1
* B2
* 0V
* BCO Kodlayıcı
* 421
* Binary
* Oktal
* H7
* H6
* H5
* H4
* H3
* H2
* H1
* H0
* H15
* H14
* H13
* H12
* H11
* H10
* H9
* H8
* HexaDesimal
* BCH Kodlayıcı
* 8421
* B0
* B1
* B2
* B3
* a
* b
* c
* d
* e
* f
* g
* a
* b
* c
* d
* e
* f
* g
* BCD
* girişler
* 7 parçalı
* kodlayıcı
* B3 B2 B1 B0 a b c d e f g
*  0   0   0    0   1 1 1 1 1 1 0
*  0   0   0    1   0 1 1 0 0 0 0
*  0   0   1    0   1 1 0 1 1 0 1
*  0   0   1    1   1 1 1 1 0 0 1
*  0   1   0    0   0 1 1 0 0 1 1
*  0   1   0    1   1 0 1 1 0 1 1
*  0   1   1    0   0 0 1 1 1 1 1
*  0   1   1    1   1 1 1 0 0 0 0
*  1   0   0    0   1 1 1 1 1 1 1
*  1   0   0    1   1 1 1 0 0 1 1
*       Doğruluk Tablosu
* a
* b
* g
* f
* e
* d
* c
* LED
* Ortak katot gösterge
.backanno
.end